# Altium schematic sheet DryContact.SchDoc
size A
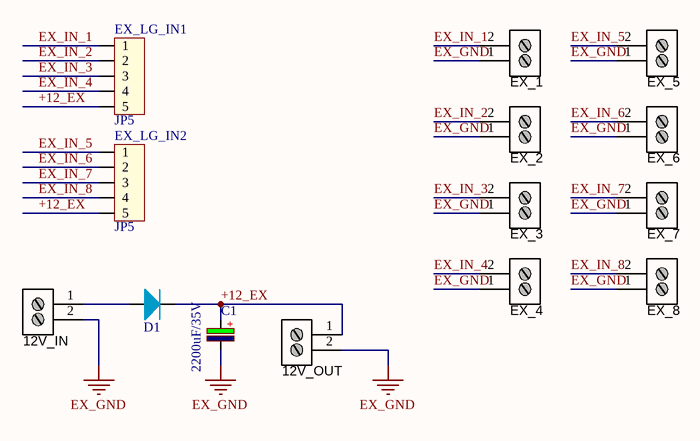
[diagram p0: DryContact.SchDoc]

## Parts
12V_IN  Stackable ScrewTerm  [2P_PCB_ScrewTerm_200mil]  (value not drawn)
12V_OUT  Stackable ScrewTerm  [2P_PCB_ScrewTerm_200mil]  (value not drawn)
C1  2200uF/35V  [CP_1000uF_25V]
D1  Diode  [Diode 3A]  (value not drawn)
EX_1  Stackable ScrewTerm  [2P_PCB_ScrewTerm_200mil]  (value not drawn)
EX_2  Stackable ScrewTerm  [2P_PCB_ScrewTerm_200mil]  (value not drawn)
EX_3  Stackable ScrewTerm  [2P_PCB_ScrewTerm_200mil]  (value not drawn)
EX_4  Stackable ScrewTerm  [2P_PCB_ScrewTerm_200mil]  (value not drawn)
EX_5  Stackable ScrewTerm  [2P_PCB_ScrewTerm_200mil]  (value not drawn)
EX_6  Stackable ScrewTerm  [2P_PCB_ScrewTerm_200mil]  (value not drawn)
EX_7  Stackable ScrewTerm  [2P_PCB_ScrewTerm_200mil]  (value not drawn)
EX_8  Stackable ScrewTerm  [2P_PCB_ScrewTerm_200mil]  (value not drawn)
EX_LG_IN1  JP5  [CON5]
EX_LG_IN2  JP5  [CON5]

## Nets
EX_GND: 12V_IN.2 12V_OUT.2 C1.2 EX_1.1 EX_2.1 EX_3.1 EX_4.1 EX_5.1 EX_6.1 EX_7.1 EX_8.1
+12_EX: 12V_OUT.1 C1.1 D1.2(K) EX_LG_IN1.5 EX_LG_IN2.5
EX_IN_1: EX_1.2 EX_LG_IN1.1
EX_IN_2: EX_2.2 EX_LG_IN1.2
EX_IN_3: EX_3.2 EX_LG_IN1.3
EX_IN_4: EX_4.2 EX_LG_IN1.4
EX_IN_5: EX_5.2 EX_LG_IN2.1
EX_IN_6: EX_6.2 EX_LG_IN2.2
EX_IN_7: EX_7.2 EX_LG_IN2.3
EX_IN_8: EX_8.2 EX_LG_IN2.4
Net12V_IN_1: 12V_IN.1 D1.1(A)

## Notes on the sheet
- (in symbol CP4) +

## Library data of the parts
12V_IN 12V_OUT EX_1-EX_8 = 2P_ScrewTerm_90S_3.81MM: Terminal Block Screw Type THT 2-Position 3.81mm pitch; Manufacturer 1: Tyco Electronics; Manufacturer Part Number 1: 1776113-2; Value: 2 position; Pitch: 0.150" (3.81mm); Positions Per Level: 2; Package / Case: Side Entry; 3.81mm pitch; Category: Connectors Interconnects; Color: Black; Supplier 1: Digi-Key; Supplier Part Number 1: A97976-ND
C1 = CP4: Cap 1000uF/16V - 220uF/50V; Description 5: 4,7uF>10uF/250V_3,3uF>10uF/400V - 2,2uF>4,7uF/450V; Description 1: 2200uF-3300uF/6,3V - 1000uF-2200uF/10V; Description 2: 1000uF/16V - 470uF => 1000uF/25V - 100uF/100V; Description 3: 330uF>470uF/35V_220uF>470uF/50V_10uF>22uF/250V; Description 4: 220uF => 330uF/63V - 10uF =>33uF/160 - 200V; Value: 1000uF/16V
EX_LG_IN1 EX_LG_IN2 = Con5: Connector 5; Value: Connector 5